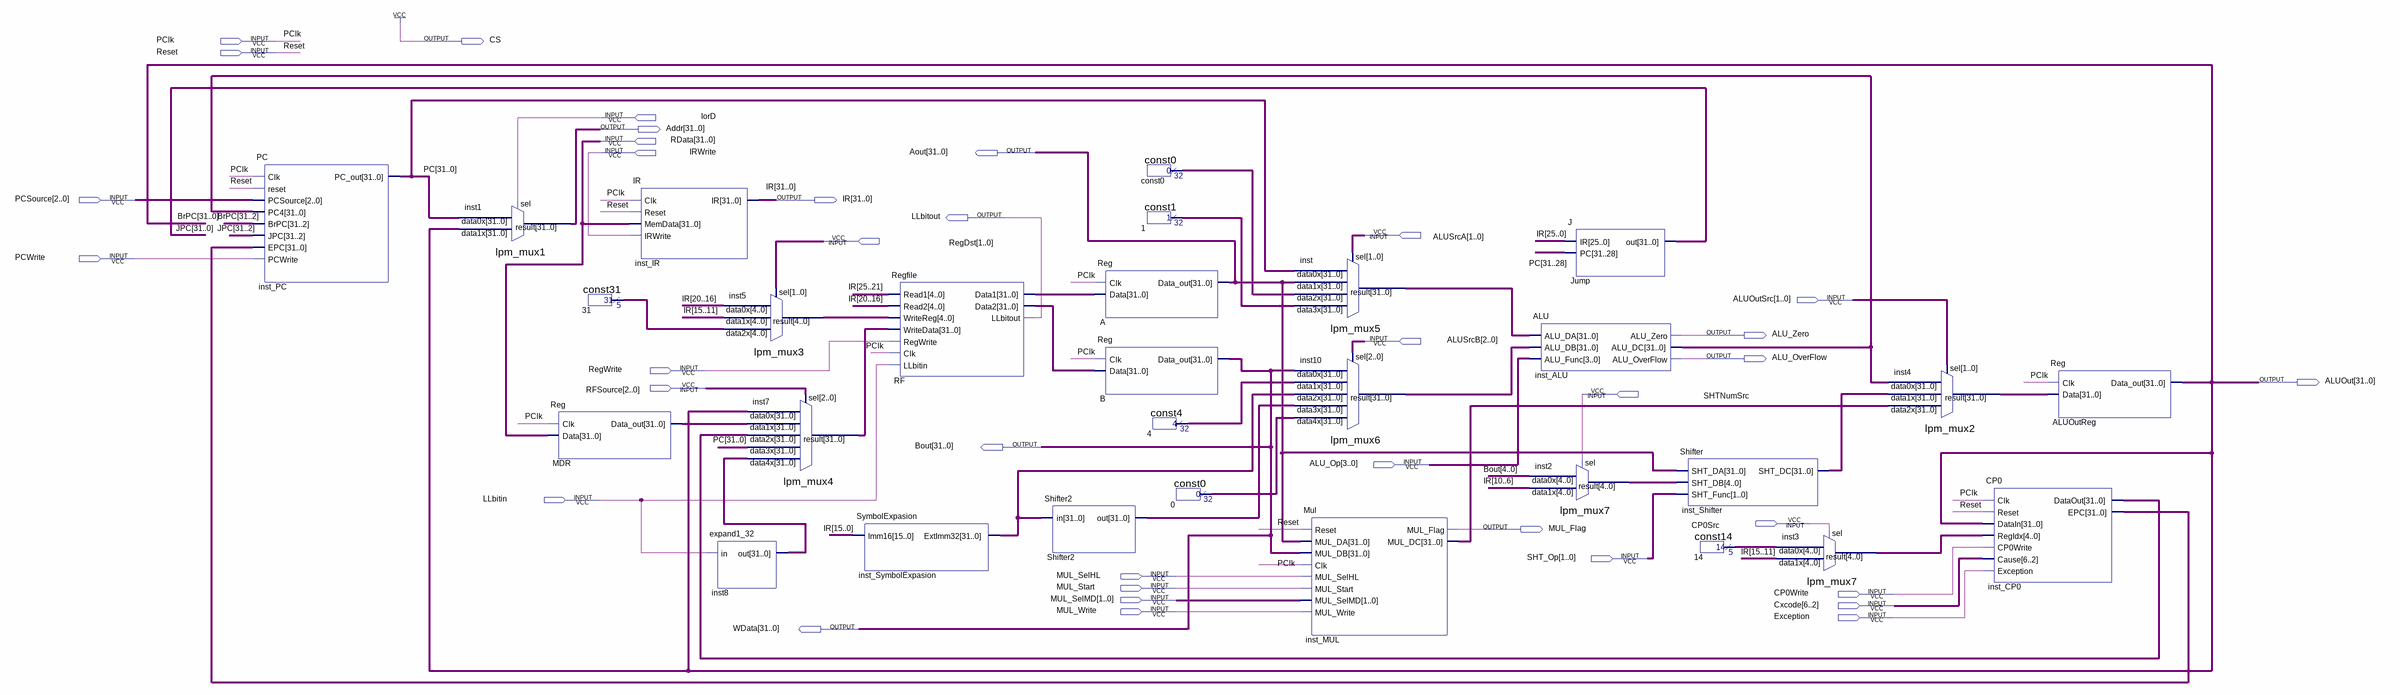
[diagram p0: schematic sheet]
// Quartus schematic MIPS.bdf as structural Verilog: 29 symbols, 36 pins
module MIPS (
  input  PClk,
  input  Reset,
  input  IorD,
  input  [31:0] RData,
  input  IRWrite,
  input  [2:0] PCSource,
  input  [1:0] ALUSrcA,
  input  [1:0] RegDst,
  input  PCWrite,
  input  [1:0] ALUOutSrc,
  input  [2:0] ALUSrcB,
  input  RegWrite,
  input  [2:0] RFSource,
  input  SHTNumSrc,
  input  [3:0] ALU_Op,
  input  LLbitin,
  input  CP0Src,
  input  [1:0] SHT_Op,
  input  MUL_SelHL,
  input  MUL_Start,
  input  CP0Write,
  input  [1:0] MUL_SelMD,
  input  [6:2] Cxcode,
  input  MUL_Write,
  input  Exception,
  output CS,
  output [31:0] Addr,
  output [31:0] Aout,
  output [31:0] IR,
  output LLbitout,
  output ALU_Zero,
  output ALU_OverFlow,
  output [31:0] ALUOut,
  output [31:0] Bout,
  output MUL_Flag,
  output [31:0] WData
);

  wire [4:0] inst2_result, inst3_result, inst5_result, n14_result, n31_result;
  wire [31:0] const0_result, inst4_result, inst7_result, inst8_out, inst10_result, inst_ALU_alu_dc,
       inst_CP0_dataout, inst_CP0_epc, inst_MUL_mul_dc, inst_result, inst_Shifter_sht_dc,
       inst_SymbolExpasion_extimm32, JPC, MDR_data_out, n0_result, n1_result, n4_result, PC, RF_data1,
       RF_data2, Shifter2_out;

  PC inst_PC (
    .Clk(PClk), .reset(Reset), .PCSource(PCSource), .PC4(inst_ALU_alu_dc), .BrPC(ALUOut[31:2]),
    .JPC(JPC[31:2]), .EPC(inst_CP0_epc), .PCWrite(PCWrite), .PC_out(PC));
  lpm_mux1 inst1 (.data1x(ALUOut), .data0x(PC), .sel(IorD), .result(Addr));
  Reg MDR (.Clk(PClk), .Data(RData), .Data_out(MDR_data_out));
  const31 u_31 (.result(n31_result));
  IR inst_IR (.Clk(PClk), .Reset(Reset), .MemData(RData), .IRWrite(IRWrite), .IR(IR));
  expand1_32 inst8 (.in(LLbitin), .out(inst8_out));
  lpm_mux3 inst5 (.data2x(n31_result), .data1x(IR[15:11]), .data0x(IR[20:16]), .sel(RegDst), .result(inst5_result));
  lpm_mux4 inst7 (
    .data4x(inst8_out), .data3x(PC), .data2x(inst_CP0_dataout), .data1x(MDR_data_out), .data0x(ALUOut),
    .sel(RFSource), .result(inst7_result));
  SymbolExpasion inst_SymbolExpasion (.Imm16(IR[15:0]), .ExtImm32(inst_SymbolExpasion_extimm32));
  Regfile RF (
    .Read1(IR[25:21]), .Read2(IR[20:16]), .WriteReg(inst5_result), .WriteData(inst7_result),
    .RegWrite(RegWrite), .Clk(PClk), .LLbitin(LLbitin), .Data1(RF_data1), .Data2(RF_data2),
    .LLbitout(LLbitout));
  Shifter2 Shifter2 (.in(inst_SymbolExpasion_extimm32), .out(Shifter2_out));
  const0 const0 (.result(const0_result));
  const1 u_1 (.result(n1_result));
  Reg A (.Clk(PClk), .Data(RF_data1), .Data_out(Aout));
  Reg B (.Clk(PClk), .Data(RF_data2), .Data_out(Bout));
  const4 u_4 (.result(n4_result));
  const0 u_0 (.result(n0_result));
  lpm_mux5 inst (
    .data3x(n1_result), .data2x(const0_result), .data1x(Aout), .data0x(PC), .sel(ALUSrcA),
    .result(inst_result));
  lpm_mux6 inst10 (
    .data4x(n0_result), .data3x(Shifter2_out), .data2x(inst_SymbolExpasion_extimm32), .data1x(n4_result),
    .data0x(Bout), .sel(ALUSrcB), .result(inst10_result));
  Mul inst_MUL (
    .Reset(Reset), .MUL_DA(Aout), .MUL_DB(Bout), .Clk(PClk), .MUL_SelHL(MUL_SelHL), .MUL_Start(MUL_Start),
    .MUL_SelMD(MUL_SelMD), .MUL_Write(MUL_Write), .MUL_Flag(MUL_Flag), .MUL_DC(inst_MUL_mul_dc));
  ALU inst_ALU (
    .ALU_DA(inst_result), .ALU_DB(inst10_result), .ALU_Func(ALU_Op), .ALU_Zero(ALU_Zero),
    .ALU_DC(inst_ALU_alu_dc), .ALU_OverFlow(ALU_OverFlow));
  lpm_mux7 inst2 (.data1x(IR[10:6]), .data0x(Bout[4:0]), .sel(SHTNumSrc), .result(inst2_result));
  J Jump (.IR(IR[25:0]), .PC(PC[31:28]), .out(JPC));
  Shifter inst_Shifter (.SHT_DA(Aout), .SHT_DB(inst2_result), .SHT_Func(SHT_Op), .SHT_DC(inst_Shifter_sht_dc));
  const14 u_14 (.result(n14_result));
  lpm_mux7 inst3 (.data1x(IR[15:11]), .data0x(n14_result), .sel(CP0Src), .result(inst3_result));
  lpm_mux2 inst4 (
    .data2x(inst_MUL_mul_dc), .data1x(inst_Shifter_sht_dc), .data0x(inst_ALU_alu_dc), .sel(ALUOutSrc),
    .result(inst4_result));
  CP0 inst_CP0 (
    .Clk(PClk), .Reset(Reset), .DataIn(ALUOut), .RegIdx(inst3_result), .CP0Write(CP0Write), .Cause(Cxcode),
    .Exception(Exception), .DataOut(inst_CP0_dataout), .EPC(inst_CP0_epc));
  Reg ALUOutReg (.Clk(PClk), .Data(inst4_result), .Data_out(ALUOut));

  assign CS = 1'b1;
  assign WData = Bout;

  // Other names for the same wires on the sheet: BrPC[31:0] = ALUOut
endmodule
